# EasyEDA schematic SCH_Thermoblock.json
TITLE: Sheet_1; REV: 1.0; Date: 2022-06-27; Sheet: 1/1; Drawn By: ivan.ziv1994; Company: Your Company
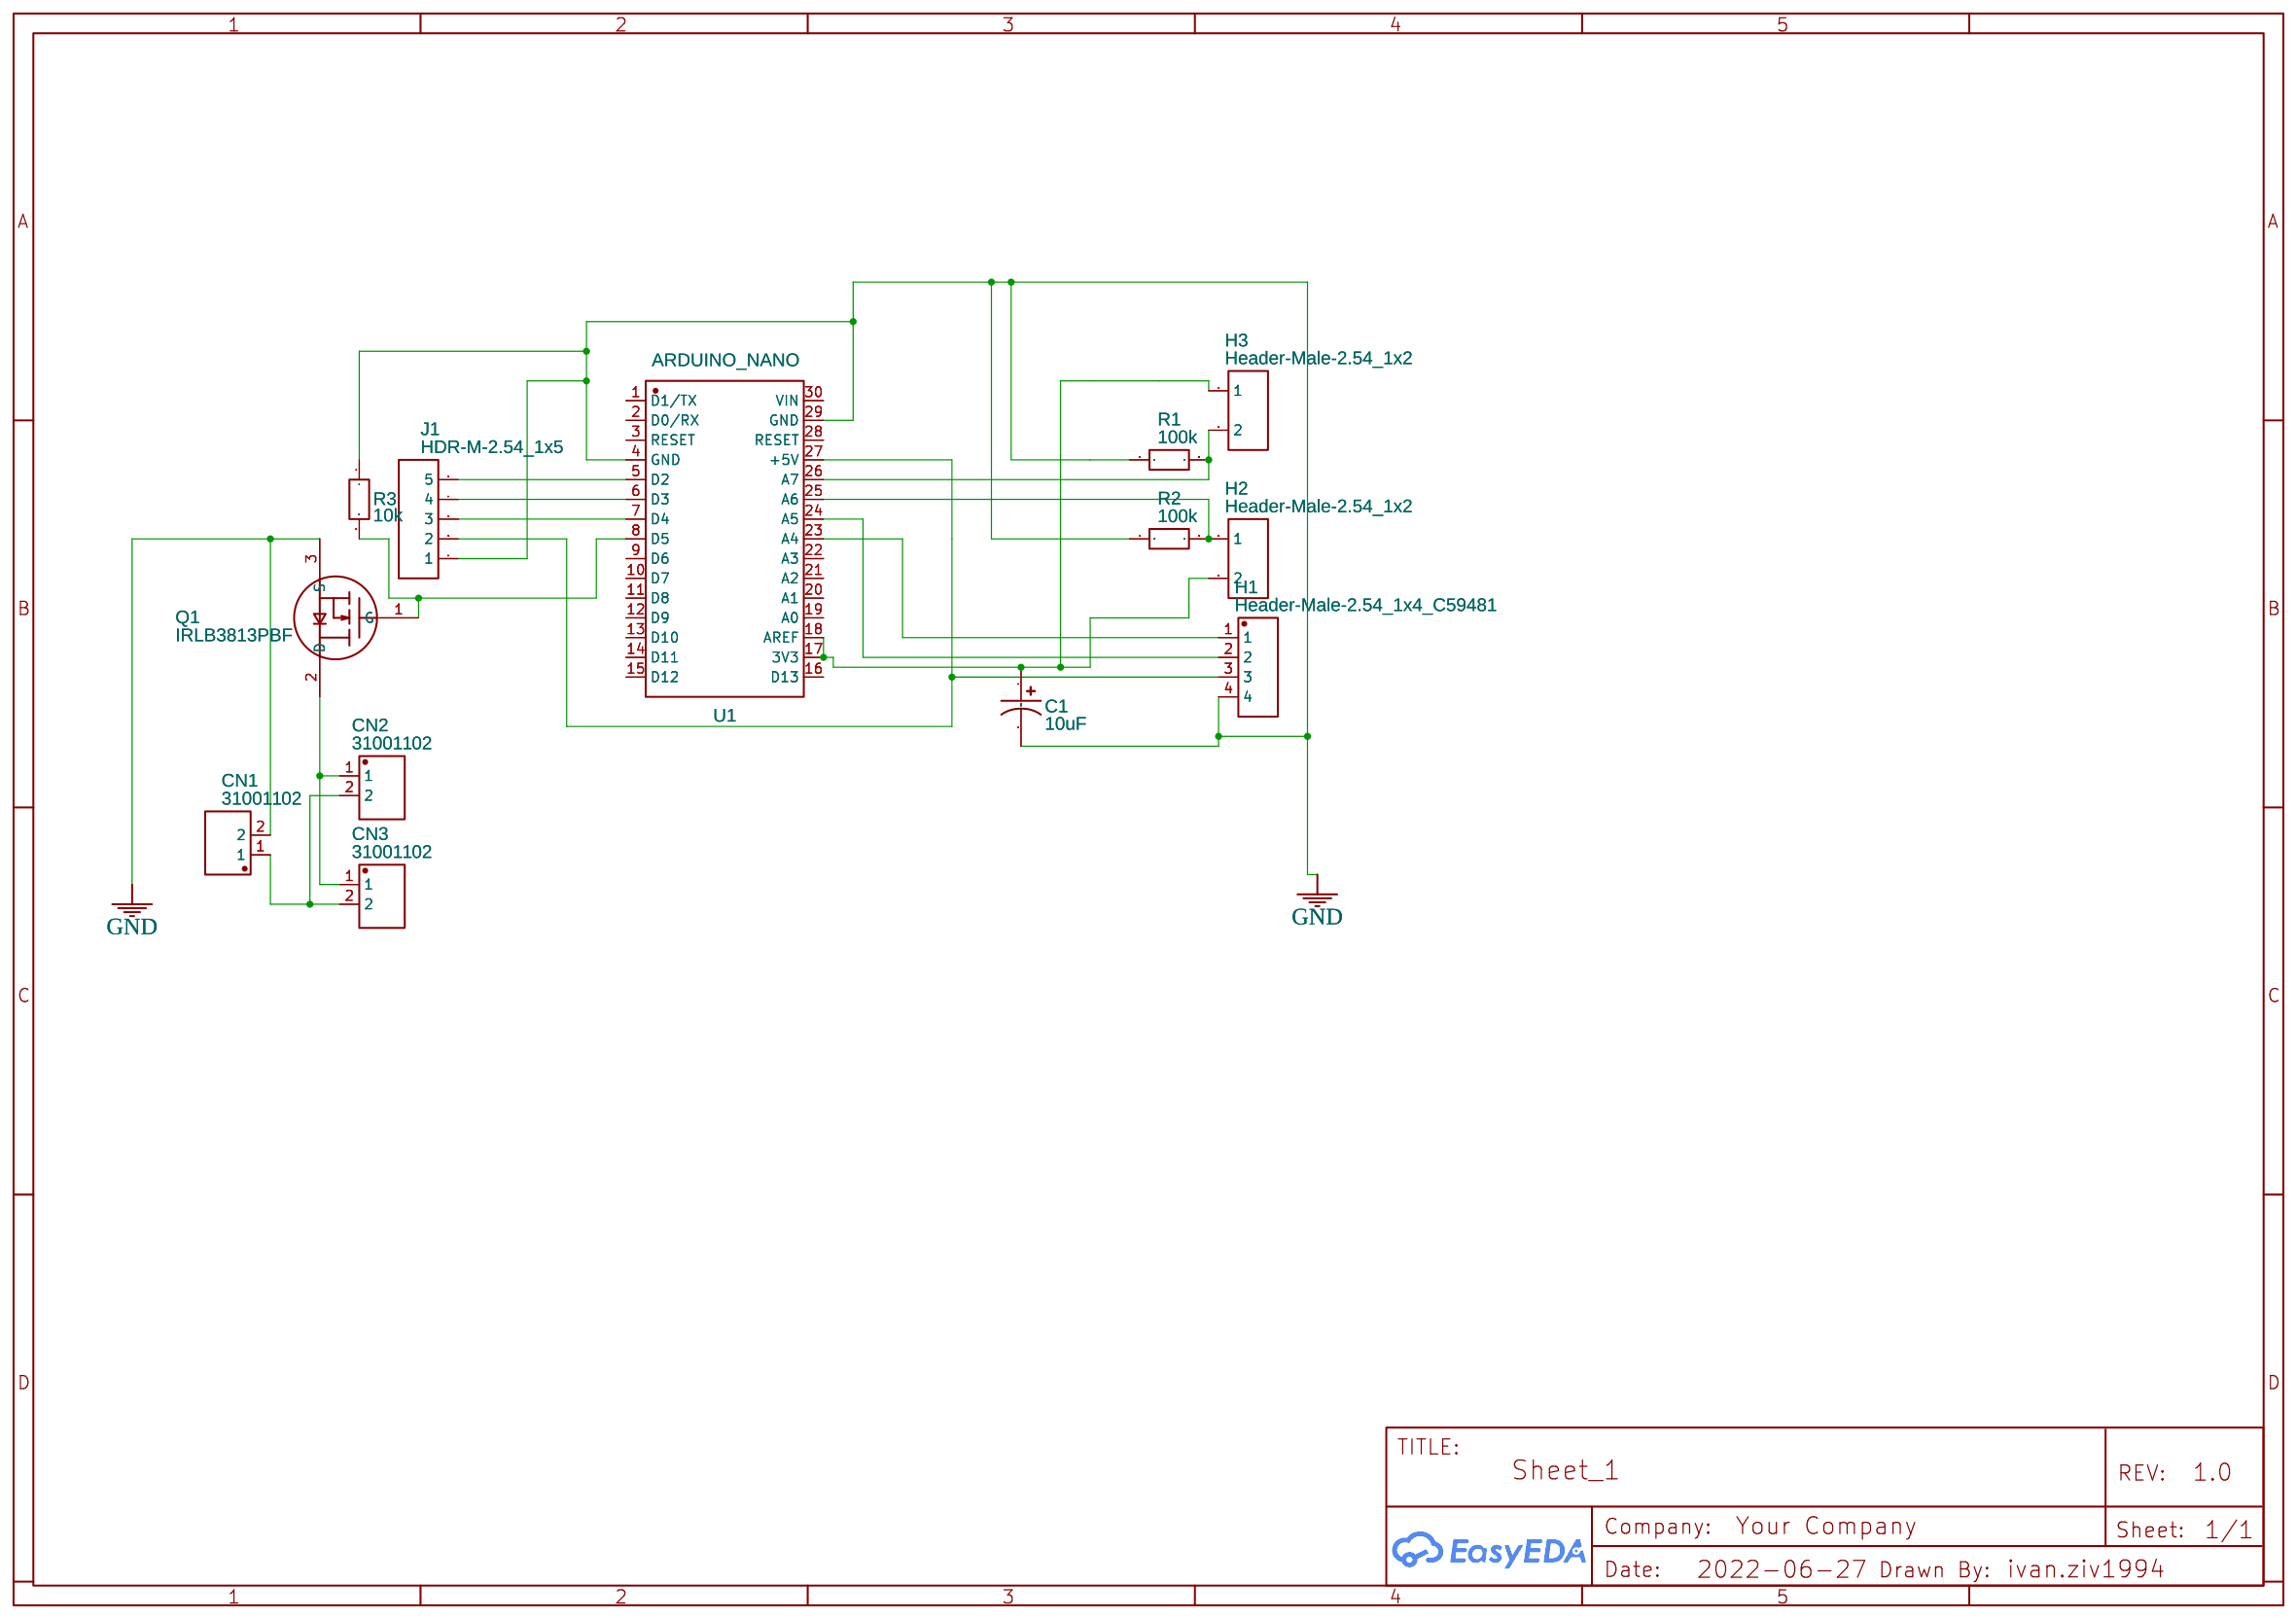
[diagram p0: schematic sheet]

## Parts
C1  10uF  [CAP-D5.0×F2.0]
CN1  31001102  [CONN-TH_2P-P5.08_31001102]
CN2  31001102  [CONN-TH_2P-P5.08_31001102]
CN3  31001102  [CONN-TH_2P-P5.08_31001102]
H1  Header-Male-2.54_1x4_C59481  [HDR-TH_4P-P2.54-V-M]
H2  Header-Male-2.54_1x2  [HDR-TH_2P-P2.54-V-M-1]
H3  Header-Male-2.54_1x2  [HDR-TH_2P-P2.54-V-M-1]
J1  HDR-M-2.54_1x5  [HDR-M-2.54_1X5]
Q1  IRLB3813PBF  [ITO-220AB-3_L10.2-W4.5-P2.60-L]
R1  100k  [R_AXIAL-0.4]
R2  100k  [R_AXIAL-0.4]
R3  10k  [R_AXIAL-0.4]
U1  ARDUINO_NANO  [COMM-TH_ARDUINO_NANO]

## Library data of the parts
C1 = CE_TH_D5.0×F2.0_US: Contributor: LCEDA_Lib
CN1-CN3 = 31001102: Supplier: LCSC; Manufacturer: METZ CONNECT; Contributor: LCSC; Supplier Part: C123210; JLCPCB Part Class: Extended Part
H1 = Header-Male-2.54_1x4_C59481: Supplier: LCSC; Manufacturer: ReliaPro; Manufacturer Part: Headers  Pins 1*4P; Supplier Part: C59481
H2 H3 = Header-Male-2.54_1x2: Supplier: LCSC; Manufacturer: TE Connectivity; Manufacturer Part: 826629-2; Supplier Part: C86471; JLCPCB Part Class: Extended Part
J1 = HDR-M-2.54_1x5: Supplier Part: C358687; Supplier: LCSC; Contributor: LCEDA_Lib
Q1 = IRLB3813PBF: Supplier: LCSC; Manufacturer: Infineon; Contributor: LCSC; Supplier Part: C148140; JLCPCB Part Class: Extended Part
R1 R3 = R_AXIAL-0.4_EU: Contributor: LCEDA_Lib
R2 = R_AXIAL-0.4_EU: Contributor: LCEDA_Lib; Package Display: No
U1 = ARDUINO_NANO: Supplier: LCSC; Supplier Part: C9900017879; Manufacturer: null; JLCPCB Part Class: Extended Part; Contributor: lcsc

## Nets
GND: C1.2 CN1.2 H1.4 J1.1 Q1.3(S) R1.1 R2.1 R3.1 U1.4(GND) U1.29(GND)
Net-(C1-1): C1.1 H2.2 H3.1 U1.17(3V3) U1.18(AREF)
Net-(CN1-1): CN1.1 CN2.2 CN3.2
Net-(CN2-1): CN2.1 CN3.1 Q1.2(D)
Net-(H1-1): H1.1 U1.23(A4)
Net-(H1-2): H1.2 U1.24(A5)
Net-(H1-3): H1.3 J1.2 U1.27(+5V)
Net-(H2-1): H2.1 R2.2 U1.25(A6)
Net-(H3-2): H3.2 R1.2 U1.26(A7)
Net-(J1-3): J1.3 U1.7(D4)
Net-(J1-4): J1.4 U1.6(D3)
Net-(J1-5): J1.5 U1.5(D2)
Net-(Q1-1): Q1.1(G) R3.2 U1.8(D5)

Not connected (* = marked no-connect by the designer): U1 1(D1/TX) 2(D0/RX) 3(RESET) 9(D6) 10(D7) 11(D8) 12(D9) 13(D10) 14(D11) 15(D12) 16(D13) 19(A0) 20(A1) 21(A2) 22(A3) 28(RESET) 30(VIN)
